# Altium schematic sheet analog inputs.schdoc
size A4
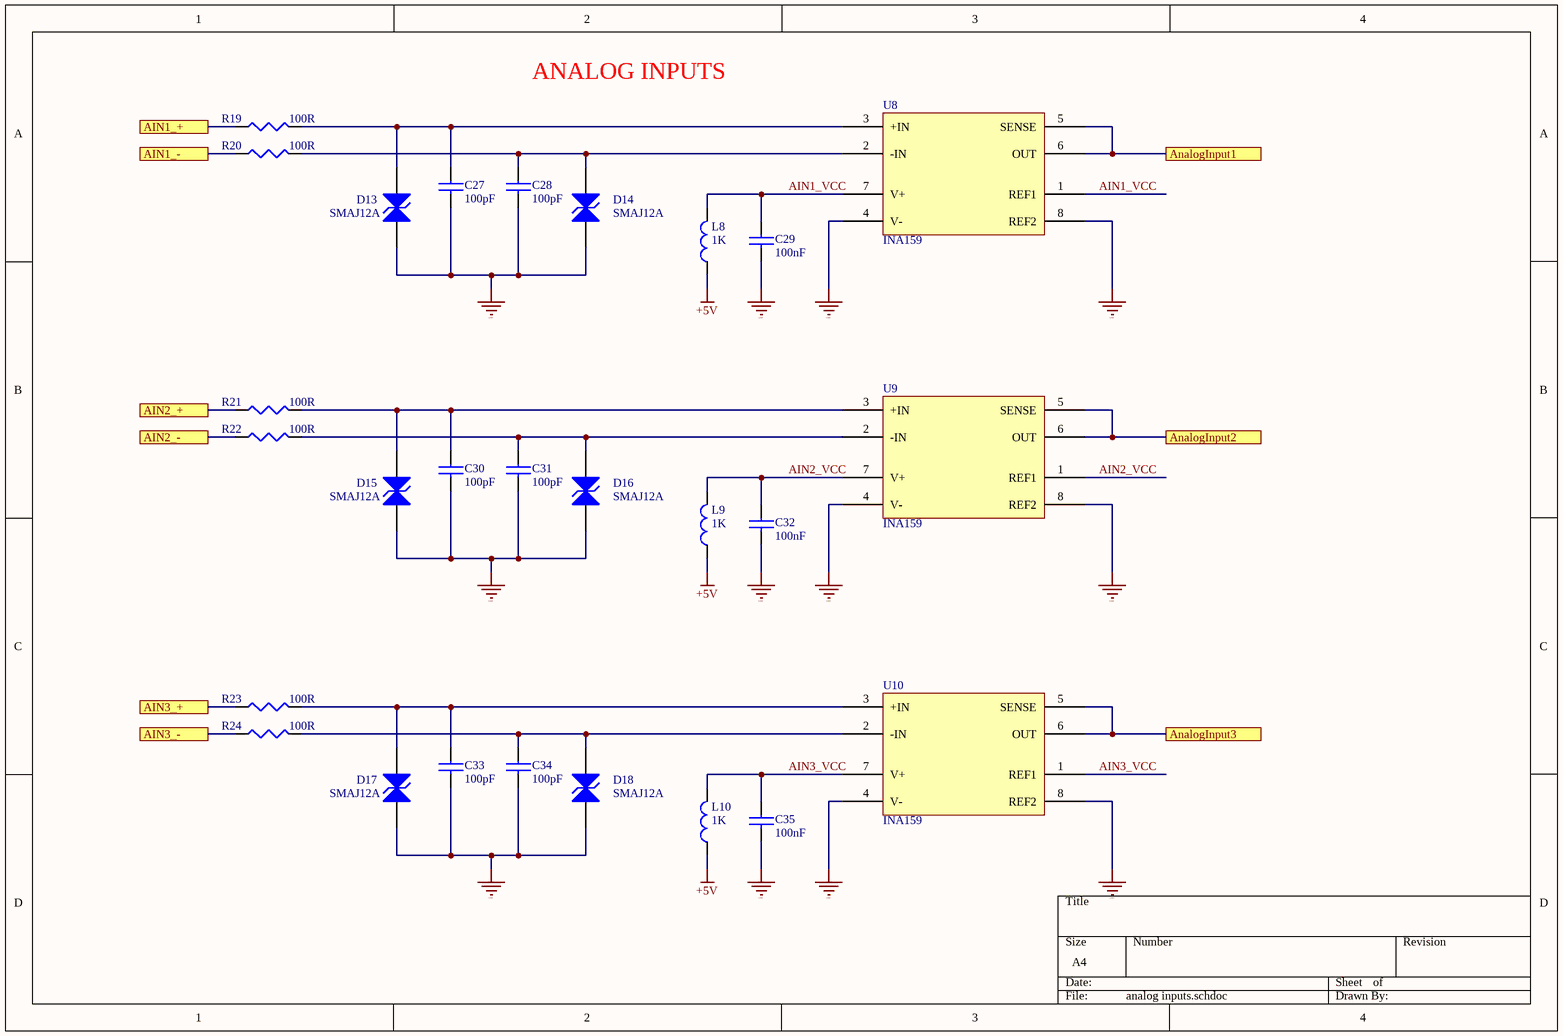
[diagram p0: analog inputs.schdoc]

## Parts
C27  value 100pF  [0805 SMD Ceramic Capacitor]  (hidden comment: C0805C101)
C28  value 100pF  [0805 SMD Ceramic Capacitor]  (hidden comment: C0805C101)
C29  value 100nF  [0805 SMD Ceramic Capacitor]  (hidden comment: C0805C104)
C30  value 100pF  [0805 SMD Ceramic Capacitor]  (hidden comment: C0805C101)
C31  value 100pF  [0805 SMD Ceramic Capacitor]  (hidden comment: C0805C101)
C32  value 100nF  [0805 SMD Ceramic Capacitor]  (hidden comment: C0805C104)
C33  value 100pF  [0805 SMD Ceramic Capacitor]  (hidden comment: C0805C101)
C34  value 100pF  [0805 SMD Ceramic Capacitor]  (hidden comment: C0805C101)
C35  value 100nF  [0805 SMD Ceramic Capacitor]  (hidden comment: C0805C104)
D13  SMAJ12A  [SMA]
D14  SMAJ12A  [SMA]
D15  SMAJ12A  [SMA]
D16  SMAJ12A  [SMA]
D17  SMAJ12A  [SMA]
D18  SMAJ12A  [SMA]
L8  value 1K  [0805 Inductor]  (hidden comment: 0805Ferrite)
L9  value 1K  [0805 Inductor]  (hidden comment: 0805Ferrite)
L10  value 1K  [0805 Inductor]  (hidden comment: 0805Ferrite)
R19  value 100R  [0805 Resistor]  (hidden comment: 0805_100R%1)
R20  value 100R  [0805 Resistor]  (hidden comment: 0805_100R%1)
R21  value 100R  [0805 Resistor]  (hidden comment: 0805_100R%1)
R22  value 100R  [0805 Resistor]  (hidden comment: 0805_100R%1)
R23  value 100R  [0805 Resistor]  (hidden comment: 0805_100R%1)
R24  value 100R  [0805 Resistor]  (hidden comment: 0805_100R%1)
U8  INA159  [VSSOP8]
U9  INA159  [VSSOP8]
U10  INA159  [VSSOP8]

## Ports
AIN1_+, AIN1_-, AIN2_+, AIN2_-, AIN3_+, AIN3_-, AnalogInput1, AnalogInput2, AnalogInput3

## Nets
+5V: L8.1 L9.1 L10.1
GND: C27.2 C28.2 C29.2 C30.2 C31.2 C32.2 C33.2 C34.2 C35.2 D13.2(K) D14.2(K) D15.2(K) D16.2(K) D17.2(K) D18.2(K) U8.4(V-) U8.8(REF2) U9.4(V-) U9.8(REF2) U10.4(V-) U10.8(REF2)
AIN1_+: R19.1 ; port AIN1_+
AIN1_-: R20.1 ; port AIN1_-
AIN1_VCC: C29.1 L8.2 U8.1(REF1) U8.7(V+)
AIN2_+: R21.1 ; port AIN2_+
AIN2_-: R22.1 ; port AIN2_-
AIN2_VCC: C32.1 L9.2 U9.1(REF1) U9.7(V+)
AIN3_+: R23.1 ; port AIN3_+
AIN3_-: R24.1 ; port AIN3_-
AIN3_VCC: C35.1 L10.2 U10.1(REF1) U10.7(V+)
AnalogInput1: U8.5(SENSE) U8.6(OUT) ; port AnalogInput1
AnalogInput2: U9.5(SENSE) U9.6(OUT) ; port AnalogInput2
AnalogInput3: U10.5(SENSE) U10.6(OUT) ; port AnalogInput3
NetC27_1: C27.1 D13.1(A) R19.2 U8.3(+IN)
NetC28_1: C28.1 D14.1(A) R20.2 U8.2(-IN)
NetC30_1: C30.1 D15.1(A) R21.2 U9.3(+IN)
NetC31_1: C31.1 D16.1(A) R22.2 U9.2(-IN)
NetC33_1: C33.1 D17.1(A) R23.2 U10.3(+IN)
NetC34_1: C34.1 D18.1(A) R24.2 U10.2(-IN)

## Notes on the sheet
- ANALOG INPUTS

## Library data of the parts
C27 C28 C30 C31 C33 C34 = C0805C101: Manufacturer: MURATA Electronics; Manufacturer Code: GRM21A5C2E101JW01D; Voltage: 250V; Tolerance: ±5%; Unit Price: 0,33 $; Package: 0805
C29 C32 C35 = C0805C104: Manufacturer Code: C0805C104J5RACTU; Manufacturer: KEMET; Voltage: 50V; Farnell Code: 1414663; Unit Price: 0,06 €; Package: 0805
D13-D18 = SMAJ12A: Manufacturer Code: SMAJ12A-E3/61; Manufacturer: VISHAY Semiconductor; Voltage: 12V; Farnell Code: 1837044; Unit Price: 0,32 €; Value: SMAJ12A
L8-L10 = 0805Ferrite: Manufacturer Code: MMZ2012R102A; Manufacturer: TDK; Current: 500mA; Farnell Code: 1669719; Unit Price: 0,059 €
R19-R24 = 0805_100R%1: Manufacturer Code: MC 0.1W 0805 1% 100R; Manufacturer: MULTICOMP; Tolerance: ±1%; Farnell Code: 9332375; Unit Price: 0,03 €
U8-U10 = INA159: Manufacturer: Texas Instruments; Manufacturer Code: INA159AIDGKR; Unit Price: 4,08$; Value: INA159